# Altium schematic sheet FTDI.SchDoc: TE0723 - FTDI
size A4; Organization: Trenz Electronic GmbH; DocumentNumber: TE0723; Revision: 01; SheetNumber: 10; SheetTotal: 12; Date: 08.07.2015; Author: Indrek Tubalkain; CompanyName: Trenz Electronic GmbH; DrawnBy: Indrek Tubalkain; Engineer: Indrek Tubalkain; ProjectName: TE0723 Arduino
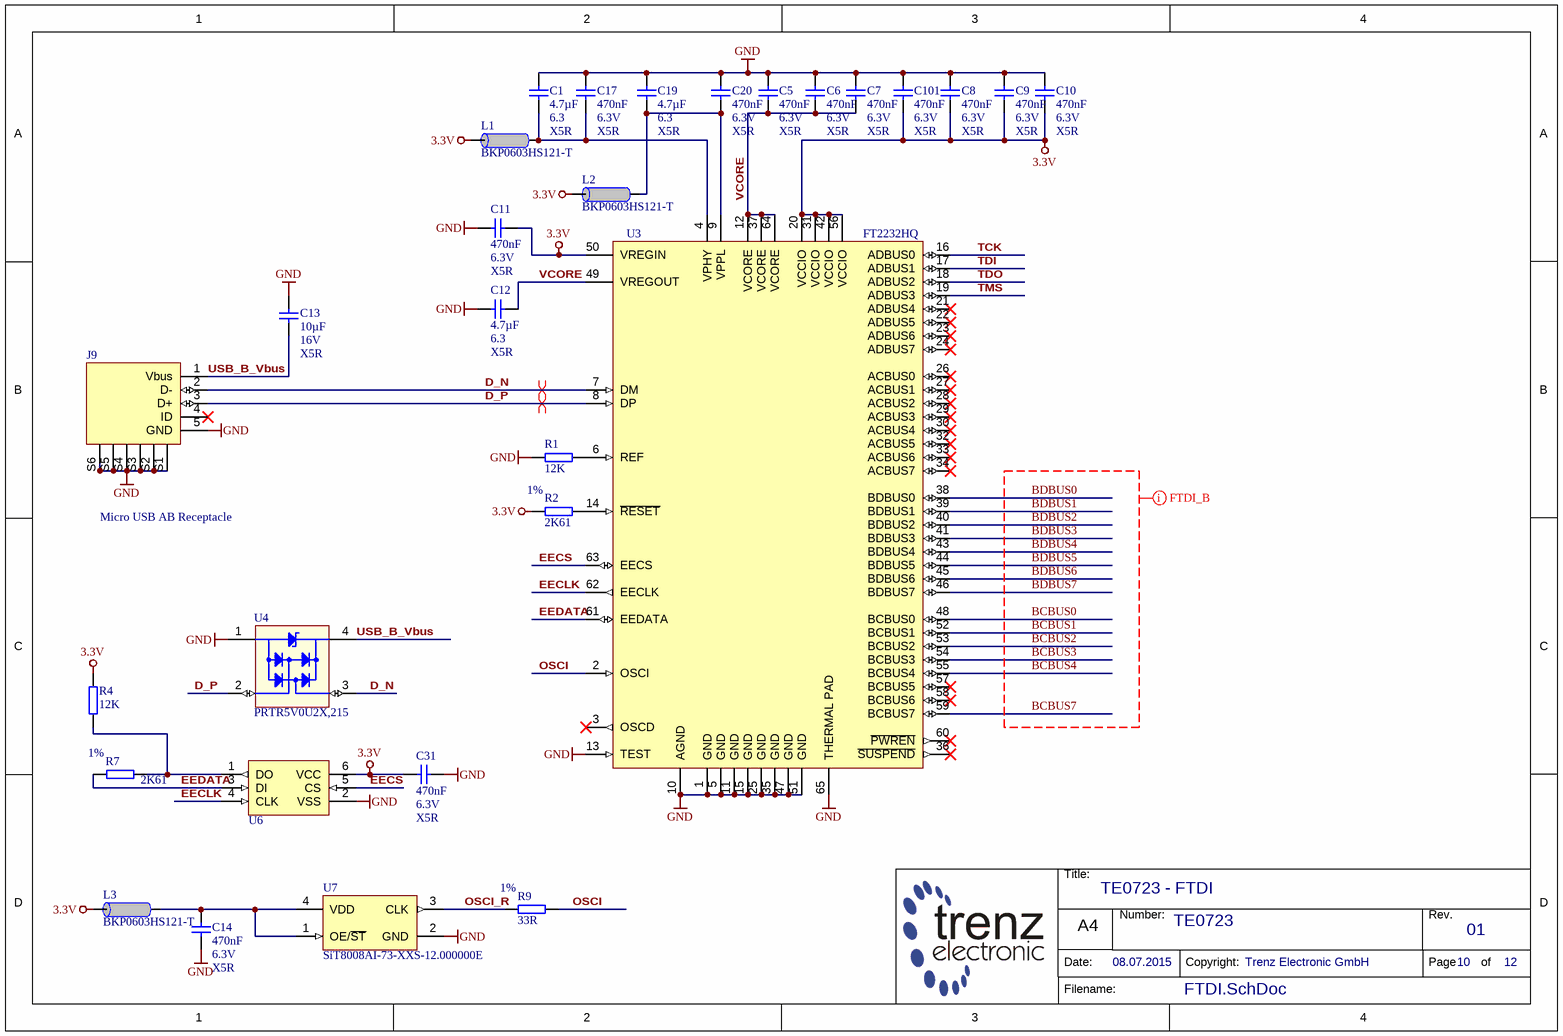
[diagram p0: FTDI.SchDoc]

## Parts
C1  4.7µF  Voltage: 6.3  Technology: X5R  [CAPC1005X60N]
C5  470nF  Voltage: 6.3V  Technology: X5R  [CAPC0603X33N]
C6  470nF  Voltage: 6.3V  Technology: X5R  [CAPC0603X33N]
C7  470nF  Voltage: 6.3V  Technology: X5R  [CAPC0603X33N]
C8  470nF  Voltage: 6.3V  Technology: X5R  [CAPC0603X33N]
C9  470nF  Voltage: 6.3V  Technology: X5R  [CAPC0603X33N]
C10  470nF  Voltage: 6.3V  Technology: X5R  [CAPC0603X33N]
C11  470nF  Voltage: 6.3V  Technology: X5R  [CAPC0603X33N]
C12  4.7µF  Voltage: 6.3  Technology: X5R  [CAPC1005X60N]
C13  10µF  Voltage: 16V  Technology: X5R  [CAPC1608X90N]
C14  470nF  Voltage: 6.3V  Technology: X5R  [CAPC0603X33N]
C17  470nF  Voltage: 6.3V  Technology: X5R  [CAPC0603X33N]
C19  4.7µF  Voltage: 6.3  Technology: X5R  [CAPC1005X60N]
C20  470nF  Voltage: 6.3V  Technology: X5R  [CAPC0603X33N]
C31  470nF  Voltage: 6.3V  Technology: X5R  [CAPC0603X33N]
C101  470nF  Voltage: 6.3V  Technology: X5R  [CAPC0603X33N]
J9  Micro USB AB Receptacle  [Micro USB ZX62-xx-5PA]
L1  BKP0603HS121-T  [INDC0603X33N]
L2  BKP0603HS121-T  [INDC0603X33N]
L3  BKP0603HS121-T  [INDC0603X33N]
R1  12K  [RESC1005X40N]
R2  2K61  Tolerance: 1%  [RESC1005X40N]
R4  12K  [RESC1005X40N]
R7  2K61  Tolerance: 1%  [RESC1005X40N]
R9  33R  Tolerance: 1%  [RESC0603X26N]
U3  FT2232HQ  [QFN50P900X900X100-65N-445]
U4  PRTR5V0U2X,215  [SOT190P229X114-4N]
U6  93AA56BT-I/OT  [SOT95P280X145-6N]  (value not drawn)
U7  SiT8008AI-73-XXS-12.000000E  [2016]

## Nets
3.3V: C8.1 C9.1 C10.1 C11.2 C31.1 C101.1 L1.2 L2.2 L3.2 R2.1 R4.2 U3.20(VCCIO) U3.31(VCCIO) U3.42(VCCIO) U3.50(VREGIN) U3.56(VCCIO) U6.6(VCC)
GND: C1.2 C5.2 C6.2 C7.2 C8.2 C9.2 C10.2 C11.1 C12.1 C13.1 C14.1 C17.2 C19.2 C20.2 C31.2 C101.2 J9.5(GND) J9.S1 J9.S2 J9.S3 J9.S4 J9.S5 J9.S6 R1.1 U3.1(GND) U3.5(GND) U3.10(AGND) U3.11(GND) U3.13(TEST) U3.15(GND) U3.25(GND) U3.35(GND) U3.47(GND) U3.51(GND) U3.65(THERMAL_PAD) U4.1(GND) U6.2(VSS) U7.2(GND)
BCBUS0: U3.48(BCBUS0)
BCBUS1: U3.52(BCBUS1)
BCBUS2: U3.53(BCBUS2)
BCBUS3: U3.54(BCBUS3)
BCBUS4: U3.55(BCBUS4)
BCBUS7: U3.59(BCBUS7)
BDBUS0: U3.38(BDBUS0)
BDBUS1: U3.39(BDBUS1)
BDBUS2: U3.40(BDBUS2)
BDBUS3: U3.41(BDBUS3)
BDBUS4: U3.43(BDBUS4)
BDBUS5: U3.44(BDBUS5)
BDBUS6: U3.45(BDBUS6)
BDBUS7: U3.46(BDBUS7)
D_N: J9.2(D-) U3.7(DM) U4.3(I/O)
D_P: J9.3(D+) U3.8(DP) U4.2(I/O)
EECLK: U3.62(EECLK) U6.4(CLK)
EECS: U3.63(EECS) U6.5(CS)
EEDATA: R7.1 U3.61(EEDATA) U6.3(DI)
OSCI: R9.2 U3.2(OSCI)
OSCI_R: R9.1 U7.3(CLK)
TCK: U3.16(ADBUS0)
TDI: U3.17(ADBUS1)
TDO: U3.18(ADBUS2)
TMS: U3.19(ADBUS3)
USB_B_Vbus: C13.2 J9.1(Vbus) U4.4(REF)
VCORE: C5.1 C6.1 C7.1 C12.2 U3.12(VCORE) U3.37(VCORE) U3.49(VREGOUT) U3.64(VCORE)
NetC1_1: C1.1 C17.1 L1.1 U3.4(VPHY)
NetC14_2: C14.2 L3.1 U7.1(OE/~{ST}) U7.4(VDD)
NetC19_1: C19.1 C20.1 L2.1 U3.9(VPPL)
NetR1_2: R1.2 U3.6(REF)
NetR2_2: R2.2 U3.14(~{RESET})
NetR4_1: R4.1 R7.2 U6.1(DO)

Not connected (* = marked no-connect by the designer): J9 4(ID)*; U3 3(OSCD)* 21(ADBUS4)* 22(ADBUS5)* 23(ADBUS6)* 24(ADBUS7)* 26(ACBUS0)* 27(ACBUS1)* 28(ACBUS2)* 29(ACBUS3)* 30(ACBUS4)* 32(ACBUS5)* 33(ACBUS6)* 34(ACBUS7)* 36(~{SUSPEND})* 57(BCBUS5)* 58(BCBUS6)* 60(~{PWREN})*

## Layout directives
differential pair: D_N, D_P
net class FTDI_B: BCBUS0, BCBUS1, BCBUS2, BCBUS3, BCBUS4, BCBUS7, BDBUS0, BDBUS1, BDBUS2, BDBUS3, BDBUS4, BDBUS5, BDBUS6, BDBUS7

## Notes on the sheet
- Title:
- Number:
- Rev.
- Date:
- A4
- Copyright:
- Page
- of
- Filename:

## Library data of the parts
C1 C12 C19 = 24719: KON 4.7µF 6.3V X5R SMD 20%; AN: 24719; Mixed: SMT; Value: 4.7u; Preferred: Yes; Case: 1005 (0402); Tolerance: 20%
C5-C11 C14 C17 C20 C31 C101 = 24921: KON 470nF X5R 6.3V SMD 20%; AN: 24921; Value: 470n; Mixed: SMT; Preferred: Yes; Case: 0603 (0201); Tolerance: 20%
C13 = 25341: KON 10µF 16V X5R SMD 20%; AN: 25341; Mixed: SMT; Value: 10u; Preferred: Yes; Case: 1608 (0603); Tolerance: 20%
J9 = 25126: Micro USB AB Buchse; AN: 25126; Mixed: SMT; Trenz-Stock: Yes; Case: Micro USB AB; HelpURL: B:\AD\adlib\datasheet\USB\USB_2.0_Spec\Micro-USB_final
L1-L3 = 25393: Ferritdurchführung SMD 0201; AN: 25393; Mixed: SMT; Trenz-Stock: Yes; Tolerance: 25%; Case: 0603 (0201); HelpURL: B:\AD\adlib\datasheet\MULTILAYER CHIP BEAD INDUCTORS BK; Preferred: Yes
R1 R4 = 22598: WID SMD 12K 1% 0,063W; AN: 22598; Mixed: SMT; Preferred: Yes; Case: 1005 (0402); Value: 12K
R2 R7 = 23730: WID SMD 2K61 1% 0,063W; AN: 23730; Mixed: SMT; Value: 2.61K; Preferred: Yes; Case: 1005 (0402)
R9 = 25021: WID SMD 33R 1% 0,05W; AN: 25021; Mixed: SMT; Value: 33; Preferred: Yes; Case: 0603 (0201); HelpURL: B:\AD\adlib\datasheet\R0201
U3 = 24727: AN: 24727; Trenz-Stock: Yes; Mixed: SMT; Case: QFN64; HelpURL: B:\AD\adlib\datasheet\FT2232H; Preferred: Yes
U4 = 24840: AN: 24840; Mixed: SMT; Preferred: Yes; Case: SOT143; HelpURL: B:\AD\adlib\datasheet\CD143A-SR05
U6 = 24730: AN: 24730; Trenz-Stock: Yes; Mixed: SMT; Case: SOT23-6; HelpURL: B:\AD\adlib\datasheet\93AA56A; Preferred: Yes
U7 = 25325: SiT8008AI-73-XXS-12.000000E MEMS Oszillator 12MHz; AN: 25325; Value: 12M; Trenz-Stock: Yes; Mixed: SMT; Case: 2.0  x 1.6mm; HelpURL: B:\AD\adlib\datasheet\SiT8008; Preferred: Yes